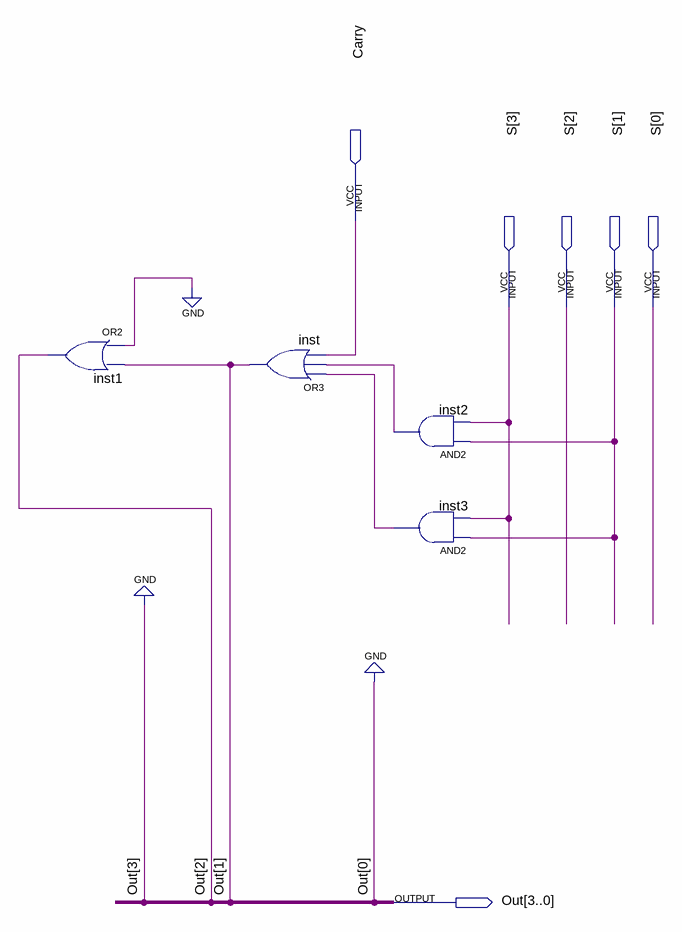
[diagram p0: schematic sheet]
// Quartus schematic SomadorBCD_parte.bdf as structural Verilog: 4 symbols, 6 pins
module SomadorBCD_parte (
  input  Carry,
  input  [3:0] S,
  output [3:0] Out
);

  wire inst2_out, inst3_out;

  or inst1 (Out[2], 1'b0, Out[1]);
  or inst (Out[1], inst3_out, inst2_out, Carry);
  and inst2 (inst2_out, S[1], S[3]);
  and inst3 (inst3_out, S[1], S[3]);

  assign {Out[3], Out[0]} = 2'b00;
endmodule
